# Altium schematic sheet waku-ctl.SchDoc (part 3 of 4)
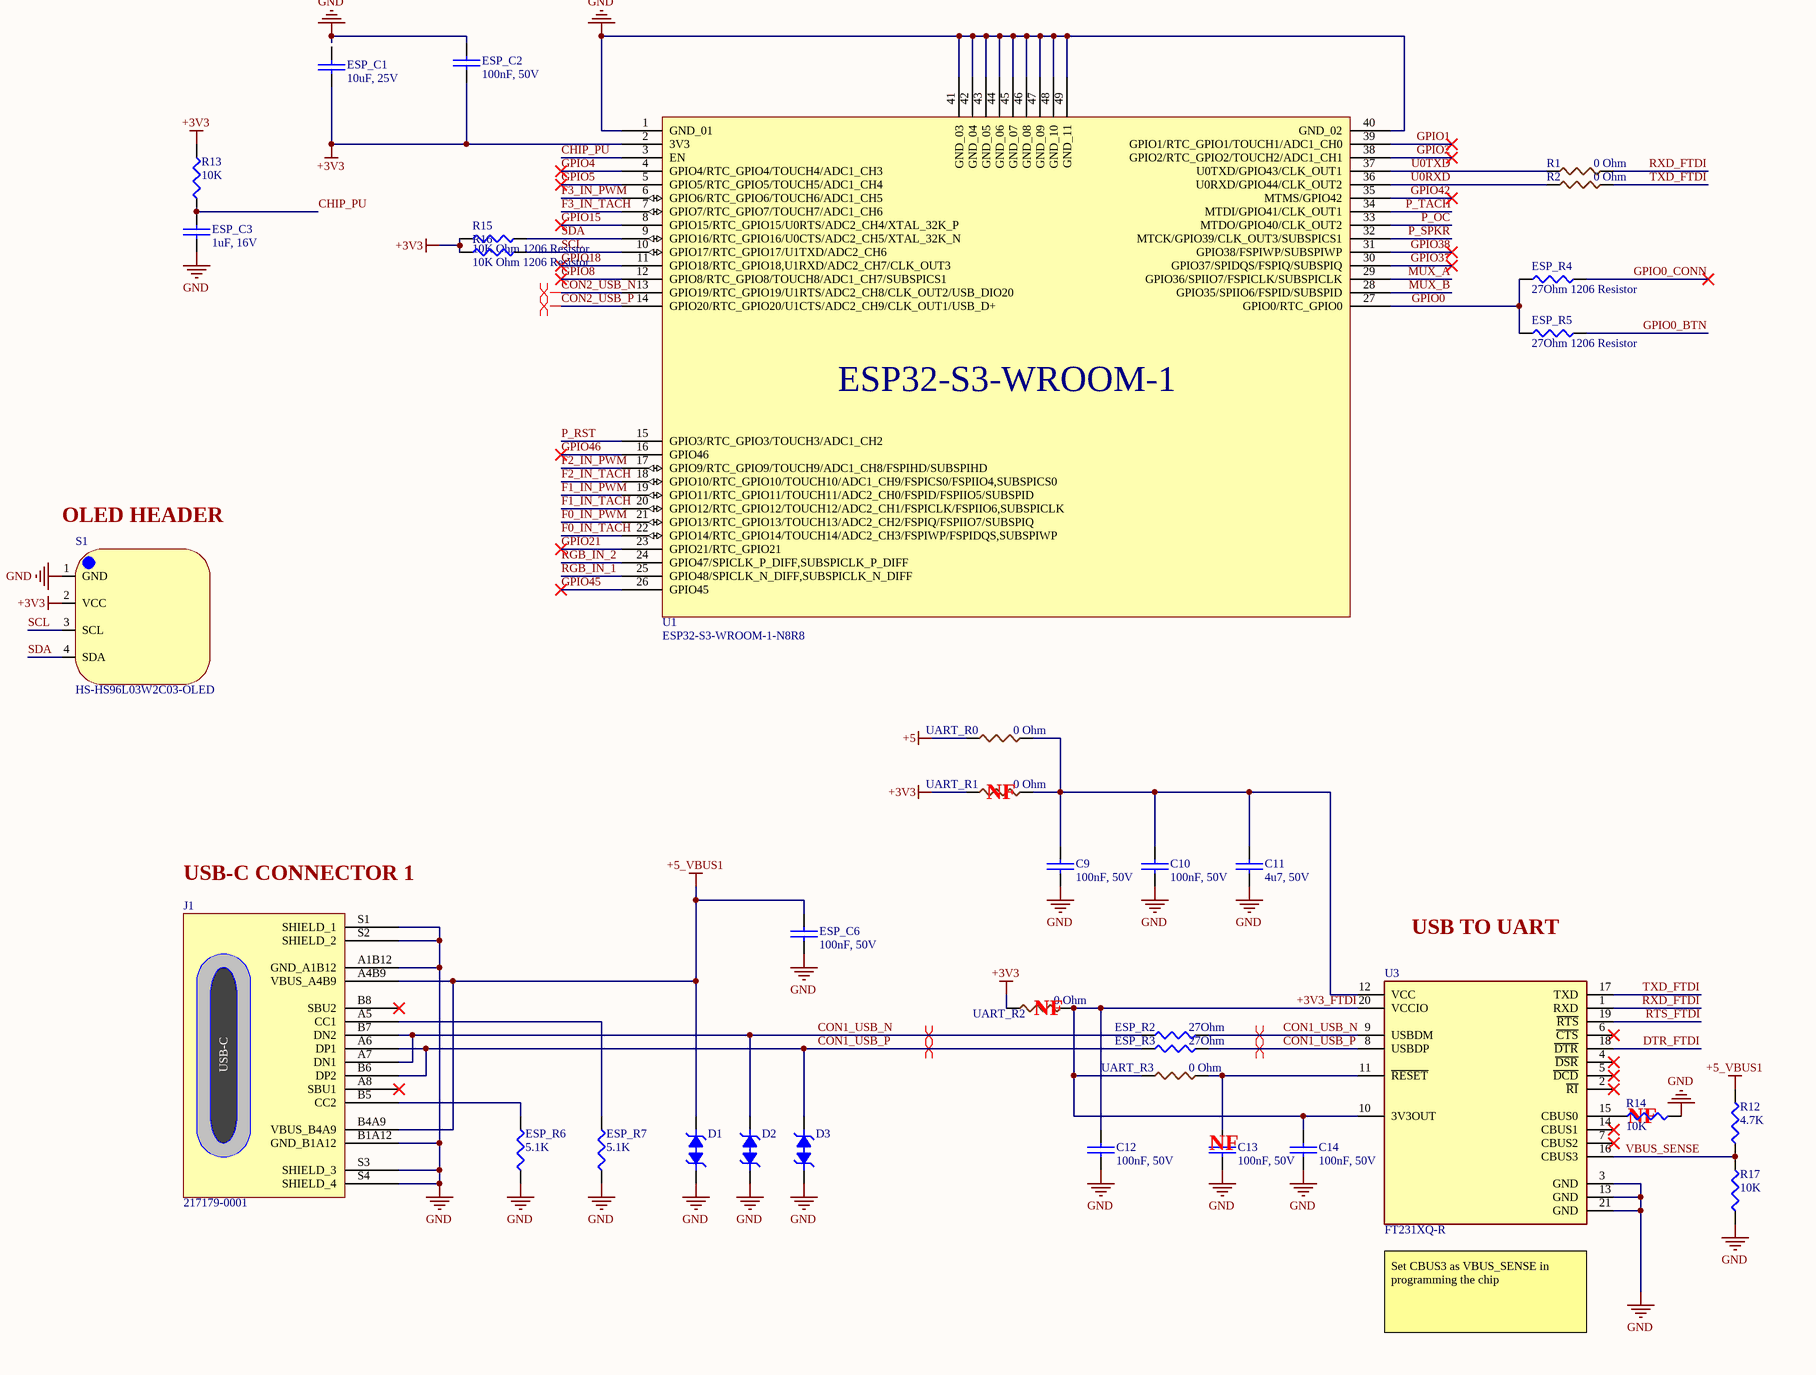
[diagram p5: waku-ctl.SchDoc, bottom right]

## Library data of the parts (continued)
J8-J12 = 47053-1000: CONN HEADER VERT 4POS 2.54MM; Manufacturer: Molex; Manufacturer Lifecycle Status: ACTIVE; Current Rating: 500mA; Dielectric Material: Polyamide; Gender: Male; Glow Wire Compliant: Non-compliant; Number of Circuits: 2; Number of Contacts: 4; Operating Force: 1.946N; Plating: Copper; Plating Thickness: 2.54µm; Voltage Rating: 500V; Voltage Rating (DC): 250V; Supplier: DigiKey; Supplier Part Number: WM4330-ND; Manufacturer Part Number: 47053-1000; RoHS: Compliant; Category: Headers and Wire Housings; Stock: 47133; Pricing: 1=0.42, 10=0.354, 100=0.42, 500=0.26844, 1000=0.25562, 5000=0.22817, 10000=0.21729 (EUR); Ambient Temperature Range High: 105°C; China RoHS: Compliant; Contact Gender: Male; Contact Material: Brass; Contact Plating: Tin; Country of Origin: HK; Depth: 5.84mm; Halogen Free: Low Halogen; Height: 7.7mm; Housing Color: Beige; Housing Material: Nylon; Lead Pitch: 2.54mm; Length: 10.2mm; Lifecycle Status: Production; Max Operating Temperature: 75°C; Min Operating Temperature: -40°C; Mounting Technology: Through Hole; Pins: 4; Number of Positions: 4; Number of Rows: 1; Orientation: Vertical; Packaging: Bulk; Pitch: 2.54mm; Radiation Hardening: No; REACH SVHC: Yes; Schedule B: 8536694040, 8536694040|8536694040|8536694040|8536694040|8536694040|8536694040|8536694040|8536694040|8536694040|8536694040|8536694040|8536694040|8536694040|8536694040|8536694040|8536694040|8536694040|8536694040|8536694040|8536694040|8536694040|8536694040|8536694040|85; Terminal Pitch: 2.54mm; Termination: Through Hole; ComponentLink1URL: https://datasheet.octopart.com:443/47053-1000-Molex-datasheet-154585791.pdf?src-supplier=Sager+Electronics; ComponentLink1Description: https://datasheet.octopart.com:443/47053-1000-Molex-datasheet-154585791.pdf?src-supplier=Sager+Electronics; ComponentLink2URL: https://datasheet.octopart.com:443/47053-1000-Molex-datasheet-13792061.pdf?src-supplier=Sager+Electronics; ComponentLink2Description: https://datasheet.octopart.com:443/47053-1000-Molex-datasheet-13792061.pdf?src-supplier=Sager+Electronics; ComponentLink3URL: https://datasheet.octopart.com:443/0470531000-Molex-datasheet-157440094.pdf?src-supplier=Sager+Electronics; ComponentLink3Description: https://datasheet.octopart.com:443/0470531000-Molex-datasheet-157440094.pdf?src-supplier=Sager+Electronics; ComponentLink4URL: https://sigma.octopart.com:443/154585790/technical_drawing/Molex-47053-1000.pdf?src-supplier=Upverter; ComponentLink4Description: https://sigma.octopart.com:443/154585790/technical_drawing/Molex-47053-1000.pdf?src-supplier=Upverter; ComponentLink5URL: https://datasheet.octopart.com:443/47053-1000-Molex-datasheet-141422371.pdf?src-supplier=Upverter; ComponentLink5Description: https://datasheet.octopart.com:443/47053-1000-Molex-datasheet-141422371.pdf?src-supplier=Upverter; ComponentLink6URL: https://datasheet.octopart.com:443/47053-1000-Molex-datasheet-154585785.pdf?src-supplier=Upverter; ComponentLink6Description: https://datasheet.octopart.com:443/47053-1000-Molex-datasheet-154585785.pdf?src-supplier=Upverter; ComponentLink7URL: https://datasheet.octopart.com:443/47053-1000-Molex-datasheet-16078519.pdf?src-supplier=TME; ComponentLink7Description: https://datasheet.octopart.com:443/47053-1000-Molex-datasheet-16078519.pdf?src-supplier=TME; ComponentLink8URL: https://datasheet.octopart.com:443/470531000-Molex-datasheet-8344792.pdf?src-supplier=Molex; ComponentLink8Description: https://datasheet.octopart.com:443/470531000-Molex-datasheet-8344792.pdf?src-supplier=Molex; ComponentLink9URL: https://datasheet.octopart.com:443/47053-1000-Molex-datasheet-101583033.pdf?src-supplier=element14+APAC; ComponentLink9Description: https://datasheet.octopart.com:443/47053-1000-Molex-datasheet-101583033.pdf?src-supplier=element14+APAC; ComponentLink10URL: https://datasheet.octopart.com:443/47053-1000-Molex-datasheet-154752195.pdf?src-supplier=Master+Electronics; ComponentLink10Description: https://datasheet.octopart.com:443/47053-1000-Molex-datasheet-154752195.pdf?src-supplier=Master+Electronics; ComponentLink11URL: https://datasheet.octopart.com:443/47053-1000-Molex-datasheet-33003494.pdf?src-supplier=Electro+Sonic; ComponentLink11Description: https://datasheet.octopart.com:443/47053-1000-Molex-datasheet-33003494.pdf?src-supplier=Electro+Sonic; ComponentLink12URL: https://datasheet.octopart.com:443/47053-1000-Molex-datasheet-62104864.pdf?src-supplier=Electro+Sonic; ComponentLink12Description: https://datasheet.octopart.com:443/47053-1000-Molex-datasheet-62104864.pdf?src-supplier=Electro+Sonic; ComponentLink13URL: https://datasheet.octopart.com:443/47053-1000-Molex-datasheet-24932734.pdf?src-supplier=Electro+Sonic; ComponentLink13Description: https://datasheet.octopart.com:443/47053-1000-Molex-datasheet-24932734.pdf?src-supplier=Electro+Sonic; ComponentLink14URL: https://datasheet.octopart.com:443/47053-1000-Molex-datasheet-140185186.pdf?src-supplier=RS+(Formerly+Allied+Electronics); ComponentLink14Description: https://datasheet.octopart.com:443/47053-1000-Molex-datasheet-140185186.pdf?src-supplier=RS+(Formerly+Allied+Electronics); ComponentLink15URL: https://datasheet.octopart.com:443/47053-1000-Molex-datasheet-120151286.pdf?src-supplier=RS+(Formerly+Allied+Electronics); ComponentLink15Description: https://datasheet.octopart.com:443/47053-1000-Molex-datasheet-120151286.pdf?src-supplier=RS+(Formerly+Allied+Electronics); ComponentLink16URL: https://datasheet.octopart.com:443/47053-1000-Molex-datasheet-31972472.pdf?src-supplier=RS+(Formerly+Allied+Electronics); ComponentLink16Description: https://datasheet.octopart.com:443/47053-1000-Molex-datasheet-31972472.pdf?src-supplier=RS+(Formerly+Allied+Electronics); ComponentLink17URL: https://datasheet.octopart.com:443/47053-1000-Molex-datasheet-37247467.pdf?src-supplier=RS+(Formerly+Allied+Electronics); ComponentLink17Description: https://datasheet.octopart.com:443/47053-1000-Molex-datasheet-37247467.pdf?src-supplier=RS+(Formerly+Allied+Electronics); ComponentLink18URL: https://datasheet.octopart.com:443/470531000-Molex-datasheet-137316104.pdf?src-supplier=Future+Electronics; ComponentLink18Description: https://datasheet.octopart.com:443/470531000-Molex-datasheet-137316104.pdf?src-supplier=Future+Electronics; ComponentLink19URL: https://datasheet.octopart.com:443/47053-1000-Molex-datasheet-42575110.pdf?src-supplier=Farnell; ComponentLink19Description: https://datasheet.octopart.com:443/47053-1000-Molex-datasheet-42575110.pdf?src-supplier=Farnell; ComponentLink20URL: https://datasheet.octopart.com:443/470531000-Molex-datasheet-151821780.pdf?src-supplier=Toby+Electronics; ComponentLink20Description: https://datasheet.octopart.com:443/470531000-Molex-datasheet-151821780.pdf?src-supplier=Toby+Electronics; ComponentLink21URL: http://sigma.octopart.com:80/16397823/rohs_statement/Molex-47053-1000.pdf?src-supplier=Compliance+Statements; ComponentLink21Description: http://sigma.octopart.com:80/16397823/rohs_statement/Molex-47053-1000.pdf?src-supplier=Compliance+Statements; ComponentLink22URL: http://sigma.octopart.com:80/conflict_mineral_statement/Molex-company-72.pdf?src-supplier=Compliance+Statements; ComponentLink22Description: http://sigma.octopart.com:80/conflict_mineral_statement/Molex-company-72.pdf?src-supplier=Compliance+Statements; ComponentLink23URL: http://sigma.octopart.com:80/rohs_statement/Molex-company-73.pdf?src-supplier=Compliance+Statements; ComponentLink23Description: http://sigma.octopart.com:80/rohs_statement/Molex-company-73.pdf?src-supplier=Compliance+Statements; ComponentLink24URL: http://sigma.octopart.com:80/reach_statement/Molex-company-74.pdf?src-supplier=Compliance+Statements; ComponentLink24Description: http://sigma.octopart.com:80/reach_statement/Molex-company-74.pdf?src-supplier=Compliance+Statements
J13 = SSQ-102-02-T-S-RA: CONN RCPT 2POS 0.1 TIN PCB R/A; Manufacturer: Samtec; Manufacturer Lifecycle Status: PRODUCTION; Connector Type: Receptacle, Socket; Contact Resistance: 10mΩ; Current Rating: 6.3A; Max Current Rating: 7.6A; Max Voltage Rating (AC): 550V; Number of Contacts: 2; Voltage Rating: 655V; Voltage Rating (AC): 465V; Supplier: DigiKey; Supplier Part Number: SAM1195-02-ND; Manufacturer Part Number: SSQ-102-02-T-S-RA; RoHS: Compliant; Category: Headers and Wire Housings; Stock: 1713; Pricing: 1=0.46, 10=0.39, 100=0.46, 500=0.29552, 1000=0.28141, 5000=0.25688 (EUR); Color: Black; Contact Material: Nickel, Tin; Contact Plating: Tin; Depth: 10.03mm; Height: 2.54mm; Housing Color: Black; Lead Free: Lead Free; Lead Length: 2.54mm; Length: 5.59mm; Lifecycle Status: Production; Max Operating Temperature: 105°C; Min Operating Temperature: -55°C; Mounting Technology: Through Hole; Number of Positions: 2; Number of Rows: 1; Orientation: Right Angle; Packaging: Bulk; Pitch: 2.54mm; Radiation Hardening: No; Termination: Solder; Voltage Rating (DC): 655V; Width: 8.51mm; ComponentLink1URL: https://datasheet.octopart.com:443/SSQ-102-02-T-S-RA-Samtec-datasheet-150873487.pdf?src-supplier=Upverter; ComponentLink1Description: https://datasheet.octopart.com:443/SSQ-102-02-T-S-RA-Samtec-datasheet-150873487.pdf?src-supplier=Upverter; ComponentLink2URL: https://sigma.octopart.com:443/17020302/technical_drawing/Samtec-SSQ-102-02-T-S-RA.pdf?src-supplier=Upverter; ComponentLink2Description: https://sigma.octopart.com:443/17020302/technical_drawing/Samtec-SSQ-102-02-T-S-RA.pdf?src-supplier=Upverter; ComponentLink3URL: https://datasheet.octopart.com:443/SSQ-102-02-T-S-RA-Samtec-datasheet-97291133.pdf?src-supplier=element14+APAC; ComponentLink3Description: https://datasheet.octopart.com:443/SSQ-102-02-T-S-RA-Samtec-datasheet-97291133.pdf?src-supplier=element14+APAC; ComponentLink4URL: https://sigma.octopart.com:443/97291134/technical_drawing/Samtec-SSQ-102-02-T-S-RA.pdf?src-supplier=Samtec; ComponentLink4Description: https://sigma.octopart.com:443/97291134/technical_drawing/Samtec-SSQ-102-02-T-S-RA.pdf?src-supplier=Samtec; ComponentLink5URL: https://datasheet.octopart.com:443/SSQ-102-02-T-S-RA-Samtec-datasheet-118235309.pdf?src-supplier=Electro+Sonic; ComponentLink5Description: https://datasheet.octopart.com:443/SSQ-102-02-T-S-RA-Samtec-datasheet-118235309.pdf?src-supplier=Electro+Sonic; ComponentLink6URL: https://datasheet.octopart.com:443/SSQ-102-02-T-S-RA-Samtec-datasheet-86818373.pdf?src-supplier=Sager+Electronics; ComponentLink6Description: https://datasheet.octopart.com:443/SSQ-102-02-T-S-RA-Samtec-datasheet-86818373.pdf?src-supplier=Sager+Electronics; ComponentLink7URL: https://datasheet.octopart.com:443/SSQ-102-02-T-S-RA-Samtec-datasheet-133811811.pdf?src-supplier=JRH+Electronics; ComponentLink7Description: https://datasheet.octopart.com:443/SSQ-102-02-T-S-RA-Samtec-datasheet-133811811.pdf?src-supplier=JRH+Electronics; LCSC Part Number: C6824759
J15-J17 = TS-104-T-AA: NEEDLE CONN HEADER VERT 4POS 2.54MM; Manufacturer: Samtec; Manufacturer Lifecycle Status: PRODUCTION; Gender: Male; Max Current Rating: 1A; Number of Contacts: 4; Supplier: DigiKey; Supplier Part Number: SAM16040-ND; Manufacturer Part Number: TS-104-T-AA; RoHS: Compliant; Category: Headers and Wire Housings; Stock: 919; Pricing: 1=0.62, 50=0.4858, 100=0.62, 500=0.3324, 1000=0.31706 (EUR); Contact Material: Brass; Contact Plating: Tin; Lifecycle Status: Production; Max Operating Temperature: 105°C; Min Operating Temperature: -55°C; Mounting Technology: Through Hole; Number of Rows: 1; Orientation: Straight; Pitch: 2.54mm; Radiation Hardening: No; REACH SVHC: No; Termination: Solder; ComponentLink1URL: https://datasheet.octopart.com:443/TS-104-T-AA-Samtec-datasheet-97318998.pdf?src-supplier=Master+Electronics; ComponentLink1Description: https://datasheet.octopart.com:443/TS-104-T-AA-Samtec-datasheet-97318998.pdf?src-supplier=Master+Electronics; ComponentLink2URL: https://datasheet.octopart.com:443/TS-104-T-AA-Samtec-datasheet-150856305.pdf?src-supplier=Electro+Sonic; ComponentLink2Description: https://datasheet.octopart.com:443/TS-104-T-AA-Samtec-datasheet-150856305.pdf?src-supplier=Electro+Sonic; ComponentLink3URL: https://datasheet.octopart.com:443/TS-104-T-AA-Samtec-datasheet-13698575.pdf?src-supplier=Electro+Sonic; ComponentLink3Description: https://datasheet.octopart.com:443/TS-104-T-AA-Samtec-datasheet-13698575.pdf?src-supplier=Electro+Sonic; ComponentLink4URL: https://datasheet.octopart.com:443/TS-104-T-AA-Samtec-datasheet-37173861.pdf?src-supplier=Electro+Sonic; ComponentLink4Description: https://datasheet.octopart.com:443/TS-104-T-AA-Samtec-datasheet-37173861.pdf?src-supplier=Electro+Sonic; ComponentLink5URL: https://datasheet.octopart.com:443/TS-104-T-AA-Samtec-datasheet-41643166.pdf?src-supplier=Farnell; ComponentLink5Description: https://datasheet.octopart.com:443/TS-104-T-AA-Samtec-datasheet-41643166.pdf?src-supplier=Farnell; ComponentLink6URL: https://datasheet.octopart.com:443/TS-104-T-AA-Samtec-datasheet-28904454.pdf?src-supplier=Farnell; ComponentLink6Description: https://datasheet.octopart.com:443/TS-104-T-AA-Samtec-datasheet-28904454.pdf?src-supplier=Farnell; ComponentLink7URL: https://datasheet.octopart.com:443/TS-104-T-AA-Samtec-datasheet-8451641.pdf?src-supplier=Farnell; ComponentLink7Description: https://datasheet.octopart.com:443/TS-104-T-AA-Samtec-datasheet-8451641.pdf?src-supplier=Farnell; ComponentLink8URL: https://datasheet.octopart.com:443/TS-104-T-AA-Samtec-datasheet-179090728.pdf?src-supplier=Sager+Electronics; ComponentLink8Description: https://datasheet.octopart.com:443/TS-104-T-AA-Samtec-datasheet-179090728.pdf?src-supplier=Sager+Electronics; ComponentLink9URL: https://datasheet.octopart.com:443/TS-104-T-AA-Samtec-datasheet-118235246.pdf?src-supplier=Sager+Electronics; ComponentLink9Description: https://datasheet.octopart.com:443/TS-104-T-AA-Samtec-datasheet-118235246.pdf?src-supplier=Sager+Electronics; ComponentLink10URL: https://datasheet.octopart.com:443/TS-104-T-AA-Samtec-datasheet-116533476.pdf?src-supplier=Toby+Electronics; ComponentLink10Description: https://datasheet.octopart.com:443/TS-104-T-AA-Samtec-datasheet-116533476.pdf?src-supplier=Toby+Electronics; ComponentLink11URL: https://datasheet.octopart.com:443/TS-104-T-AA-Samtec-datasheet-116536303.pdf?src-supplier=Toby+Electronics; ComponentLink11Description: https://datasheet.octopart.com:443/TS-104-T-AA-Samtec-datasheet-116536303.pdf?src-supplier=Toby+Electronics
JMP1 JMP2 = M50-1920005: CONN SHUNT 1.27MM; Manufacturer: Harwin; Contact Resistance: 20mΩ; Current Rating: 1A; Insulation Resistance: 1GΩ; Number of Positions: 2; Voltage Rating: 500V; Supplier: DigiKey; Supplier Part Number: 952-1727-ND; Manufacturer Part Number: M50-1920005; RoHS: Compliant; Category: Headers and Wire Housings; Stock: 2688; Pricing: 1=0.33, 10=0.284, 25=0.2664, 50=0.2536, 100=0.2414, 250=0.22628, 500=0.21546, 1000=0.20516, 3000=0.18984 (USD); Color: Red; Contact Gender: Female; Contact Plating: Gold; Flammability Rating: UL94 V-0; Height: 2.9972mm; Housing Material: Nylon; Lifecycle Status: Production; Max Operating Temperature: 105°C; Min Operating Temperature: -40°C; Pins: 2; Pitch: 1.27mm; REACH SVHC: Yes; ComponentLink1URL: https://datasheet.octopart.com:443/M50-1920005-Harwin-datasheet-179992058.pdf?src-supplier=IHS; ComponentLink1Description: https://datasheet.octopart.com:443/M50-1920005-Harwin-datasheet-179992058.pdf?src-supplier=IHS; ComponentLink2URL: https://datasheet.octopart.com:443/M50-1920005-Harwin-datasheet-27707384.pdf?src-supplier=Newark; ComponentLink2Description: https://datasheet.octopart.com:443/M50-1920005-Harwin-datasheet-27707384.pdf?src-supplier=Newark; ComponentLink3URL: https://datasheet.octopart.com:443/M50-1920005-Harwin-datasheet-10841850.pdf?src-supplier=element14+APAC; ComponentLink3Description: https://datasheet.octopart.com:443/M50-1920005-Harwin-datasheet-10841850.pdf?src-supplier=element14+APAC; LCSC Part Number: C2758458
OP1 = PS2701A-1-F3-A: OPTOISO 3.75KV 1CH TRANS 4-SOP; Manufacturer: Renesas; Manufacturer Lifecycle Status: ACTIVE; Collector Emitter Breakdown Voltage: 70V; Collector Emitter Saturation Voltage: 300mV; Current Transfer Ratio: 50%; Dark Current: 100nA; Fall Time: 7µs; Forward Current: 50mA; Forward Voltage: 1.4V; Input Current: 5mA; Max Collector Current: 30mA; Max Power Dissipation: 230mW; Number of Channels: 1; Output Voltage: 40V; RAM Size: 16kB; Reverse Breakdown Voltage: 6V; Rise Time: 5µs; Supplier: DigiKey; Supplier Part Number: 559-1154-1-ND; Manufacturer Part Number: PS2701A-1-F3-A; RoHS: Compliant; Category: Optocouplers; Stock: 13270; Pricing: 1=0.84, 10=0.591, 100=0.84, 500=0.36802, 1000=0.34545 (EUR); Case/Package: SOP; China RoHS: Compliant; Collector Emitter Voltage (VCEO): 70V; Contact Plating: Tin Bismuth; Export Control Classification Number (ECCN) Code: EAR99; Part Family: PS2701A-1; Height: 2.3mm; Harmonized Tariff Schedule (HTS) Code: 8541.49.8000; Isolation Voltage: 3.75kV; Lead Free: Lead Free; Lifecycle Status: Production; Max Input Current: 30mA; Max Operating Temperature: 100°C; Max Output Voltage: 70V; Min Operating Temperature: -55°C; MSL: 1; Mounting Technology: Surface Mount; Number of Circuits: 1; Number of Elements: 1; Pins: 4; Power Dissipation: 230mW; Radiation Hardening: No; REACH SVHC: Yes; Reverse Voltage: 6V; ComponentLink1URL: https://datasheet.octopart.com:443/PS2701A-1-F3-A-Renesas-datasheet-157819089.pdf?src-supplier=Newark; ComponentLink1Description: https://datasheet.octopart.com:443/PS2701A-1-F3-A-Renesas-datasheet-157819089.pdf?src-supplier=Newark; ComponentLink2URL: https://datasheet.octopart.com:443/PS2701A-1-F3-A-Renesas-datasheet-179182223.pdf?src-supplier=Integrated+Device+Technology; ComponentLink2Description: https://datasheet.octopart.com:443/PS2701A-1-F3-A-Renesas-datasheet-179182223.pdf?src-supplier=Integrated+Device+Technology; ComponentLink3URL: https://datasheet.octopart.com:443/PS2701A-1-F3-A-Renesas-datasheet-149188193.pdf?src-supplier=Integrated+Device+Technology; ComponentLink3Description: https://datasheet.octopart.com:443/PS2701A-1-F3-A-Renesas-datasheet-149188193.pdf?src-supplier=Integrated+Device+Technology; ComponentLink4URL: https://datasheet.octopart.com:443/PS2701A-1-F3-A-NEC-datasheet-180895236.pdf?src-supplier=IHS; ComponentLink4Description: https://datasheet.octopart.com:443/PS2701A-1-F3-A-NEC-datasheet-180895236.pdf?src-supplier=IHS; ComponentLink5URL: https://datasheet.octopart.com:443/PS2701A-1-F3-A-Renesas-datasheet-141895261.pdf?src-supplier=Renesas; ComponentLink5Description: https://datasheet.octopart.com:443/PS2701A-1-F3-A-Renesas-datasheet-141895261.pdf?src-supplier=Renesas; ComponentLink6URL: https://datasheet.octopart.com:443/PS2701A-1-F3-A-Renesas-datasheet-138175344.pdf?src-supplier=Renesas; ComponentLink6Description: https://datasheet.octopart.com:443/PS2701A-1-F3-A-Renesas-datasheet-138175344.pdf?src-supplier=Renesas; ComponentLink7URL: https://datasheet.octopart.com:443/PS2701A-1-F3-A-Renesas-datasheet-5436770.pdf?src-supplier=element14+APAC; ComponentLink7Description: https://datasheet.octopart.com:443/PS2701A-1-F3-A-Renesas-datasheet-5436770.pdf?src-supplier=element14+APAC; ComponentLink8URL: https://datasheet.octopart.com:443/PS2701A-1-F3-A-Renesas-datasheet-164380605.pdf?src-supplier=SOS+electronic; ComponentLink8Description: https://datasheet.octopart.com:443/PS2701A-1-F3-A-Renesas-datasheet-164380605.pdf?src-supplier=SOS+electronic; ComponentLink9URL: https://datasheet.octopart.com:443/PS2701A-1-F3-A-Renesas-datasheet-134697512.pdf?src-supplier=TME; ComponentLink9Description: https://datasheet.octopart.com:443/PS2701A-1-F3-A-Renesas-datasheet-134697512.pdf?src-supplier=TME; ComponentLink10URL: https://datasheet.octopart.com:443/PS2701A-1-F3-A-Renesas-datasheet-136482170.pdf?src-supplier=Future+Electronics; ComponentLink10Description: https://datasheet.octopart.com:443/PS2701A-1-F3-A-Renesas-datasheet-136482170.pdf?src-supplier=Future+Electronics; ComponentLink11URL: http://sigma.octopart.com:80/conflict_mineral_statement/Renesas-company-44.pdf?src-supplier=Compliance+Statements; ComponentLink11Description: http://sigma.octopart.com:80/conflict_mineral_statement/Renesas-company-44.pdf?src-supplier=Compliance+Statements; ComponentLink12URL: http://sigma.octopart.com:80/reach_statement/Renesas-company-45.pdf?src-supplier=Compliance+Statements; ComponentLink12Description: http://sigma.octopart.com:80/reach_statement/Renesas-company-45.pdf?src-supplier=Compliance+Statements
Q2 Q3 = SS8050-G: TRANS NPN 25V 1.5A SOT-23-3; Manufacturer: Comchip; Collector Base Voltage (VCBO): 40V; Collector Emitter Saturation Voltage: 500mV; Emitter Base Voltage (VEBO): 5V; hFE Min: 40; Max Junction Temperature (Tj): 150°C; Max Power Dissipation: 300mW; Number of Elements: 1; Transition Frequency: 100MHz; Supplier: DigiKey; Supplier Part Number: 641-1790-1-ND; Manufacturer Part Number: SS8050-G; RoHS: Compliant; Category: BJTs; Stock: 59487; Pricing: 1=0.2, 10=0.126, 100=0.2, 500=0.05756, 1000=0.05078 (EUR); Case/Package: TO-236-3; Collector Emitter Breakdown Voltage: 25V; Collector Emitter Voltage (VCEO): 25V; Height: 1.15mm; Lifecycle Status: Production; Max Breakdown Voltage: 25V; Max Collector Current: 1.5A; Max Operating Temperature: 150°C; Mounting Technology: Surface Mount; Number of Terminals: 3; Power Dissipation: 300mW; REACH SVHC: Yes; Schedule B: 8541100070|8541100070|8541100070|8541100070|8541100070; ComponentLink1URL: https://datasheet.octopart.com:443/SS8050-G-Comchip-datasheet-180131983.pdf?src-supplier=IHS; ComponentLink1Description: https://datasheet.octopart.com:443/SS8050-G-Comchip-datasheet-180131983.pdf?src-supplier=IHS; ComponentLink2URL: https://datasheet.octopart.com:443/SS8050-G-Comchip-datasheet-155422643.pdf?src-supplier=Upverter; ComponentLink2Description: https://datasheet.octopart.com:443/SS8050-G-Comchip-datasheet-155422643.pdf?src-supplier=Upverter; ComponentLink3URL: https://datasheet.octopart.com:443/SS8050-G-Comchip-datasheet-189767092.pdf?src-supplier=ODG+(Origin+Data+Global); ComponentLink3Description: https://datasheet.octopart.com:443/SS8050-G-Comchip-datasheet-189767092.pdf?src-supplier=ODG+(Origin+Data+Global); LCSC Part Number: C164886
R1 R2 UART_R0-UART_R3 = RC1206FR-070RL: RES 0 OHM JUMPER 1/4W 1206; Manufacturer: Yageo Group; Max Power Dissipation: 250mW; Value: 0Ω; Tolerance: 1%; Voltage Rating: 200V; Supplier: DigiKey; Supplier Part Number: YAG3367CT-ND; Manufacturer Part Number: RC1206FR-070RL; RoHS: Compliant; Category: Chip SMD Resistors; Pricing: 1=0.1, 10=0.027, 25=0.0228, 50=0.02, 100=0.0175, 250=0.0148, 500=0.0131, 1000=0.01164, 5000=0.00905, 10000=0.00821, 15000=0.00777, 25000=0.00728, 35000=0.00698, 50000=0.0067, 60000=0.00656, 120000=0.00608, 125000=0.00606 (USD); Case/Package: 1206; Case Code (Imperial): 1206; Case Code (Metric): 3216; China RoHS: Non-Compliant; Composition: Thick Film; Contact Plating: Tin; Features: Moisture Resistant; Height: 550µm; Lead Free: Lead Free; Length: 3.0988mm; Lifecycle Status: Production; Max Operating Temperature: 155°C; Min Operating Temperature: -55°C; Mounting Technology: Surface Mount; Number of Terminals: 2; Number of Terminations: 2; Packaging: Tape & Reel; Power Dissipation: 250mW; Power Rating: 250mW; Radiation Hardening: No; REACH SVHC: Yes; Width: 1.6mm; ComponentLink1URL: https://datasheet.octopart.com:443/RC1206FR-070RL-Yageo-datasheet-141265859.pdf?src-supplier=Upverter; ComponentLink1Description: https://datasheet.octopart.com:443/RC1206FR-070RL-Yageo-datasheet-141265859.pdf?src-supplier=Upverter; ComponentLink2URL: https://datasheet.octopart.com:443/RC1206FR-070RL-Yageo-datasheet-8359522.pdf?src-supplier=IHS; ComponentLink2Description: https://datasheet.octopart.com:443/RC1206FR-070RL-Yageo-datasheet-8359522.pdf?src-supplier=IHS; ComponentLink3URL: https://datasheet.octopart.com:443/RC1206FR-070RL-Yageo-datasheet-164759695.pdf?src-supplier=Future+Electronics; ComponentLink3Description: https://datasheet.octopart.com:443/RC1206FR-070RL-Yageo-datasheet-164759695.pdf?src-supplier=Future+Electronics; ComponentLink4URL: https://datasheet.octopart.com:443/RC1206FR-070RL-Yageo-datasheet-137700087.pdf?src-supplier=Future+Electronics; ComponentLink4Description: https://datasheet.octopart.com:443/RC1206FR-070RL-Yageo-datasheet-137700087.pdf?src-supplier=Future+Electronics; ComponentLink5URL: https://datasheet.octopart.com:443/RC1206FR-070RL-Yageo-datasheet-27233761.pdf?src-supplier=Future+Electronics; ComponentLink5Description: https://datasheet.octopart.com:443/RC1206FR-070RL-Yageo-datasheet-27233761.pdf?src-supplier=Future+Electronics; ComponentLink6URL: https://datasheet.octopart.com:443/RC1206FR-070RL-Yageo-datasheet-13032847.pdf?src-supplier=Future+Electronics; ComponentLink6Description: https://datasheet.octopart.com:443/RC1206FR-070RL-Yageo-datasheet-13032847.pdf?src-supplier=Future+Electronics; ComponentLink7URL: https://datasheet.octopart.com/RC1206FR-070RL-Yageo-datasheet-73766026.pdf; ComponentLink7Description: https://datasheet.octopart.com/RC1206FR-070RL-Yageo-datasheet-73766026.pdf; ComponentLink8URL: http://sigma.octopart.com:80/rohs_statement/Yageo-company-2.pdf?src-supplier=Compliance+Statements; ComponentLink8Description: http://sigma.octopart.com:80/rohs_statement/Yageo-company-2.pdf?src-supplier=Compliance+Statements; ComponentLink9URL: http://sigma.octopart.com:80/conflict_mineral_statement/Yageo-company-3.pdf?src-supplier=Compliance+Statements; ComponentLink9Description: http://sigma.octopart.com:80/conflict_mineral_statement/Yageo-company-3.pdf?src-supplier=Compliance+Statements; LCSC Part Number: C137394
R3-R6 R8-R11 R13-R20 = RC1206FR-0710KL: RES 10K OHM 1% 1/4W 1206; Manufacturer: Yageo Group; Power Dissipation: 250mW; Value: 10kΩ; Temperature Coefficient: 100ppm/°C; Voltage Rating: 200V; Supplier: DigiKey; Supplier Part Number: 311-10.0KFRCT-ND; Manufacturer Part Number: RC1206FR-0710KL; RoHS: Compliant; Category: Chip SMD Resistors; Stock: 1065455; Pricing: 1=0.09, 10=0.015, 25=0.09, 50=0.0096 (EUR); Case/Package: 1206; Case Code (Imperial): 1206; Case Code (Metric): 3216; China RoHS: Non-Compliant; Composition: Thick Film; Depth: 1.6mm; Height: 550µm; Lead Free: Lead Free; Length: 3.1mm; Lifecycle Status: Production; Max Operating Temperature: 155°C; Military Standard: Not; Min Operating Temperature: -55°C; Mounting Technology: Surface Mount; Pins: 2; Number of Terminals: 2; Packaging: Cut Tape; Power Rating: 250mW; REACH SVHC: Yes; Schedule B: 8533210045, 8533210045|8533210045|8533210045|8533210045|8533210045|8533210045|8533210045|8533210045|8533210045|8533210045|8533210045|8533210045|8533210045|8533210045|8533210045|8533210045|8533210045, 8533210045|8533210045|8533210045|8533210045|8533210045|8533210045|8533210045|8533210045|8533210045|8533210045|8533210045|8533210045|8533210045|8533210045|8533210045|8533210045|8533210045|8533210045, 8533210045|8533210045|8533210045|8533210045|8533210045|8533210045|8533210045|8533210045|8533210045|8533210045|8533210045|8533210045|8533210045|8533210045|8533210045|8533210045|8533210045|8533210045|8533210045; Termination: SMD/SMT; Tolerance: 1%; Voltage Rating (AC): 200V; Voltage Rating (DC): 200V; Width: 1.6mm; Working Voltage: 200V; ComponentLink1URL: https://datasheet.octopart.com:443/RC1206FR-0710KL-Yageo-datasheet-175887523.pdf?src-supplier=IHS; ComponentLink1Description: https://datasheet.octopart.com:443/RC1206FR-0710KL-Yageo-datasheet-175887523.pdf?src-supplier=IHS; ComponentLink2URL: https://datasheet.octopart.com:443/RC1206FR-0710KL-Yageo-datasheet-103092701.pdf?src-supplier=Upverter; ComponentLink2Description: https://datasheet.octopart.com:443/RC1206FR-0710KL-Yageo-datasheet-103092701.pdf?src-supplier=Upverter; ComponentLink3URL: https://datasheet.octopart.com:443/RC1206FR-0710KL-Yageo-datasheet-98239111.pdf?src-supplier=Upverter; ComponentLink3Description: https://datasheet.octopart.com:443/RC1206FR-0710KL-Yageo-datasheet-98239111.pdf?src-supplier=Upverter; ComponentLink4URL: https://datasheet.octopart.com:443/RC1206FR-0710KL-Yageo-datasheet-8359522.pdf?src-supplier=TME; ComponentLink4Description: https://datasheet.octopart.com:443/RC1206FR-0710KL-Yageo-datasheet-8359522.pdf?src-supplier=TME; ComponentLink5URL: https://datasheet.octopart.com:443/RC1206FR-0710KL-Yageo-datasheet-13032847.pdf?src-supplier=Farnell; ComponentLink5Description: https://datasheet.octopart.com:443/RC1206FR-0710KL-Yageo-datasheet-13032847.pdf?src-supplier=Farnell; ComponentLink6URL: https://datasheet.octopart.com:443/RC1206FR-0710KL-Yageo-datasheet-62067350.pdf?src-supplier=Farnell; ComponentLink6Description: https://datasheet.octopart.com:443/RC1206FR-0710KL-Yageo-datasheet-62067350.pdf?src-supplier=Farnell; ComponentLink7URL: https://datasheet.octopart.com:443/RC1206FR-0710KL-Yageo-datasheet-176638170.pdf?src-supplier=JRH+Electronics; ComponentLink7Description: https://datasheet.octopart.com:443/RC1206FR-0710KL-Yageo-datasheet-176638170.pdf?src-supplier=JRH+Electronics; ComponentLink8URL: https://datasheet.octopart.com:443/RC1206FR-0710KL-Yageo-datasheet-164759695.pdf?src-supplier=Future+Electronics; ComponentLink8Description: https://datasheet.octopart.com:443/RC1206FR-0710KL-Yageo-datasheet-164759695.pdf?src-supplier=Future+Electronics; ComponentLink9URL: https://datasheet.octopart.com:443/RC1206FR-0710KL-Yageo-datasheet-137700087.pdf?src-supplier=Future+Electronics; ComponentLink9Description: https://datasheet.octopart.com:443/RC1206FR-0710KL-Yageo-datasheet-137700087.pdf?src-supplier=Future+Electronics; ComponentLink10URL: https://datasheet.octopart.com:443/RC1206FR-0710KL-Yageo-datasheet-27233761.pdf?src-supplier=Future+Electronics; ComponentLink10Description: https://datasheet.octopart.com:443/RC1206FR-0710KL-Yageo-datasheet-27233761.pdf?src-supplier=Future+Electronics; ComponentLink11URL: https://datasheet.octopart.com:443/RC1206FR-0710KL-Yageo-datasheet-8324387.pdf?src-supplier=Future+Electronics; ComponentLink11Description: https://datasheet.octopart.com:443/RC1206FR-0710KL-Yageo-datasheet-8324387.pdf?src-supplier=Future+Electronics; ComponentLink12URL: https://datasheet.octopart.com:443/RC1206FR-0710KL-Yageo-datasheet-79472498.pdf?src-supplier=Megastar; ComponentLink12Description: https://datasheet.octopart.com:443/RC1206FR-0710KL-Yageo-datasheet-79472498.pdf?src-supplier=Megastar; ComponentLink13URL: https://datasheet.octopart.com/RC1206FR-0710KL-Yageo-datasheet-73766026.pdf; ComponentLink13Description: https://datasheet.octopart.com/RC1206FR-0710KL-Yageo-datasheet-73766026.pdf; ComponentLink14URL: https://datasheet.octopart.com:443/RC1206FR-0710KL-Yageo-datasheet-118639.pdf?src-supplier=DigiKey; ComponentLink14Description: https://datasheet.octopart.com:443/RC1206FR-0710KL-Yageo-datasheet-118639.pdf?src-supplier=DigiKey; ComponentLink15URL: https://datasheet.octopart.com:443/RC1206FR-0710KL-Yageo-datasheet-499455.pdf?src-supplier=element14; ComponentLink15Description: https://datasheet.octopart.com:443/RC1206FR-0710KL-Yageo-datasheet-499455.pdf?src-supplier=element14; ComponentLink16URL: https://datasheet.octopart.com:443/RC1206FR-0710KL-Yageo-datasheet-6387275.pdf?src-supplier=element14; ComponentLink16Description: https://datasheet.octopart.com:443/RC1206FR-0710KL-Yageo-datasheet-6387275.pdf?src-supplier=element14; ComponentLink17URL: http://sigma.octopart.com:80/rohs_statement/Yageo-company-2.pdf?src-supplier=Compliance+Statements; ComponentLink17Description: http://sigma.octopart.com:80/rohs_statement/Yageo-company-2.pdf?src-supplier=Compliance+Statements; ComponentLink18URL: http://sigma.octopart.com:80/conflict_mineral_statement/Yageo-company-3.pdf?src-supplier=Compliance+Statements; ComponentLink18Description: http://sigma.octopart.com:80/conflict_mineral_statement/Yageo-company-3.pdf?src-supplier=Compliance+Statements; LCSC Part Number: C132649
R7 = RC1206FR-071KL: RES 1K OHM 1% 1/4W 1206; Manufacturer: Yageo Group; Power Dissipation: 250mW; Value: 1kΩ; Temperature Coefficient: 100ppm/°C; Voltage Rating: 200V; Supplier: DigiKey; Supplier Part Number: 311-1.00KFRCT-ND; Manufacturer Part Number: RC1206FR-071KL; RoHS: Compliant; Category: Chip SMD Resistors; Pricing: 1=0.09, 10=0.035, 25=0.09, 50=0.0218, 100=0.0181, 250=0.01444, 500=0.01234, 1000=0.01069 (EUR); Case/Package: 1206; Case Code (Imperial): 1206; Case Code (Metric): 3216; China RoHS: Non-Compliant; Composition: Thick Film; Depth: 1.6mm; Height: 550µm; Lead Free: Lead Free; Length: 3.2mm; Lifecycle Status: Production; Max Operating Temperature: 155°C; Military Standard: Not; Min Operating Temperature: -55°C; Mounting Technology: Surface Mount; Pins: 2; Number of Terminals: 2; Packaging: Tape & Reel; Power Rating: 250mW; REACH SVHC: Yes; Schedule B: 8533210045, 8533210045|8533210045, 8533210045|8533210045|8533210045, 8533210045|8533210045|8533210045|8533210045; Termination: SMD/SMT; Tolerance: 1%; Voltage Rating (AC): 200V; Voltage Rating (DC): 200V; Width: 1.6mm; Working Voltage: 200V; ComponentLink1URL: https://datasheet.octopart.com:443/RC1206FR-071KL-Yageo-datasheet-175887523.pdf?src-supplier=Newark; ComponentLink1Description: https://datasheet.octopart.com:443/RC1206FR-071KL-Yageo-datasheet-175887523.pdf?src-supplier=Newark; ComponentLink2URL: https://datasheet.octopart.com:443/RC1206FR-071KL-Yageo-datasheet-103092701.pdf?src-supplier=Upverter; ComponentLink2Description: https://datasheet.octopart.com:443/RC1206FR-071KL-Yageo-datasheet-103092701.pdf?src-supplier=Upverter; ComponentLink3URL: https://datasheet.octopart.com:443/RC1206FR-071KL-Yageo-datasheet-98239111.pdf?src-supplier=Upverter; ComponentLink3Description: https://datasheet.octopart.com:443/RC1206FR-071KL-Yageo-datasheet-98239111.pdf?src-supplier=Upverter; ComponentLink4URL: https://datasheet.octopart.com:443/RC1206FR-071KL-Yageo-datasheet-8359522.pdf?src-supplier=element14+APAC; ComponentLink4Description: https://datasheet.octopart.com:443/RC1206FR-071KL-Yageo-datasheet-8359522.pdf?src-supplier=element14+APAC; ComponentLink5URL: https://datasheet.octopart.com:443/RC1206FR-071KL-Yageo-datasheet-13032847.pdf?src-supplier=element14+APAC; ComponentLink5Description: https://datasheet.octopart.com:443/RC1206FR-071KL-Yageo-datasheet-13032847.pdf?src-supplier=element14+APAC; ComponentLink6URL: https://datasheet.octopart.com:443/RC1206FR-071KL-Yageo-datasheet-62067350.pdf?src-supplier=Farnell; ComponentLink6Description: https://datasheet.octopart.com:443/RC1206FR-071KL-Yageo-datasheet-62067350.pdf?src-supplier=Farnell; ComponentLink7URL: https://datasheet.octopart.com:443/RC1206FR-071KL-Yageo-datasheet-164759695.pdf?src-supplier=Future+Electronics; ComponentLink7Description: https://datasheet.octopart.com:443/RC1206FR-071KL-Yageo-datasheet-164759695.pdf?src-supplier=Future+Electronics; ComponentLink8URL: https://datasheet.octopart.com:443/RC1206FR-071KL-Yageo-datasheet-137700087.pdf?src-supplier=Future+Electronics; ComponentLink8Description: https://datasheet.octopart.com:443/RC1206FR-071KL-Yageo-datasheet-137700087.pdf?src-supplier=Future+Electronics; ComponentLink9URL: https://datasheet.octopart.com:443/RC1206FR-071KL-Yageo-datasheet-27233761.pdf?src-supplier=Future+Electronics; ComponentLink9Description: https://datasheet.octopart.com:443/RC1206FR-071KL-Yageo-datasheet-27233761.pdf?src-supplier=Future+Electronics; ComponentLink10URL: https://datasheet.octopart.com:443/RC1206FR-071KL-Yageo-datasheet-8324387.pdf?src-supplier=Future+Electronics; ComponentLink10Description: https://datasheet.octopart.com:443/RC1206FR-071KL-Yageo-datasheet-8324387.pdf?src-supplier=Future+Electronics; ComponentLink11URL: https://datasheet.octopart.com:443/RC1206FR-071KL-Yageo-datasheet-79472498.pdf?src-supplier=Megastar; ComponentLink11Description: https://datasheet.octopart.com:443/RC1206FR-071KL-Yageo-datasheet-79472498.pdf?src-supplier=Megastar; ComponentLink12URL: https://datasheet.octopart.com/RC1206FR-071KL-Yageo-datasheet-73766026.pdf; ComponentLink12Description: https://datasheet.octopart.com/RC1206FR-071KL-Yageo-datasheet-73766026.pdf; ComponentLink13URL: https://datasheet.octopart.com:443/RC1206FR-071KL-Yageo-datasheet-118639.pdf?src-supplier=DigiKey; ComponentLink13Description: https://datasheet.octopart.com:443/RC1206FR-071KL-Yageo-datasheet-118639.pdf?src-supplier=DigiKey; ComponentLink14URL: http://sigma.octopart.com:80/rohs_statement/Yageo-company-2.pdf?src-supplier=Compliance+Statements; ComponentLink14Description: http://sigma.octopart.com:80/rohs_statement/Yageo-company-2.pdf?src-supplier=Compliance+Statements; ComponentLink15URL: http://sigma.octopart.com:80/conflict_mineral_statement/Yageo-company-3.pdf?src-supplier=Compliance+Statements; ComponentLink15Description: http://sigma.octopart.com:80/conflict_mineral_statement/Yageo-company-3.pdf?src-supplier=Compliance+Statements; LCSC Part Number: C131398
R12 = RC1206FR-074K7L: RES 4.7K OHM 1% 1/4W 1206; Manufacturer: Yageo Group; Max Power Dissipation: 250mW; Value: 4.7kΩ; Temperature Coefficient: 100ppm/°C; Voltage Rating: 200V; Supplier: DigiKey; Supplier Part Number: 311-4.70KFRCT-ND; Manufacturer Part Number: RC1206FR-074K7L; RoHS: Compliant; Category: Chip SMD Resistors; Stock: 1277228; Pricing: 1=0.1, 10=0.015, 25=0.0136, 50=0.0102 (USD); Case/Package: 1206; Case Code (Imperial): 1206; Case Code (Metric): 3216; China RoHS: Non-Compliant; Composition: Thick Film; Depth: 1.6mm; Features: Moisture Resistant; Height: 550µm; Lead Free: Lead Free; Length: 3.1mm; Lifecycle Status: Production; Max Operating Temperature: 155°C; Military Standard: Not; Min Operating Temperature: -55°C; Mounting Technology: Surface Mount; Pins: 2; Number of Terminals: 2; Number of Terminations: 2; Packaging: Tape & Reel; Power Dissipation: 250mW; Power Rating: 250mW; REACH SVHC: Yes; Schedule B: 8533210045, 8533210045|8533210045|8533210045|8533210045|8533210045|8533210045|8533210045|8533210045|8533210045|8533210045|8533210045|8533210045|8533210045|8533210045|8533210045|8533210045|8533210045|8533210045|8533210045|8533210045|8533210045|8533210045|8533210045|85; Termination: SMD/SMT; Tolerance: 1%; Voltage Rating (AC): 200V; Voltage Rating (DC): 200V; Width: 1.6mm; Working Voltage: 200V; ComponentLink1URL: https://datasheet.octopart.com:443/RC1206FR-074K7L-Yageo-datasheet-175887523.pdf?src-supplier=IHS; ComponentLink1Description: https://datasheet.octopart.com:443/RC1206FR-074K7L-Yageo-datasheet-175887523.pdf?src-supplier=IHS; ComponentLink2URL: https://datasheet.octopart.com:443/RC1206FR-074K7L-Yageo-datasheet-141265859.pdf?src-supplier=Upverter; ComponentLink2Description: https://datasheet.octopart.com:443/RC1206FR-074K7L-Yageo-datasheet-141265859.pdf?src-supplier=Upverter; ComponentLink3URL: https://datasheet.octopart.com:443/RC1206FR-074K7L-Yageo-datasheet-103092701.pdf?src-supplier=Upverter; ComponentLink3Description: https://datasheet.octopart.com:443/RC1206FR-074K7L-Yageo-datasheet-103092701.pdf?src-supplier=Upverter; ComponentLink4URL: https://sigma.octopart.com:443/138820526/technical_drawing/Yageo-RC1206FR-074K7L.pdf?src-supplier=Upverter; ComponentLink4Description: https://sigma.octopart.com:443/138820526/technical_drawing/Yageo-RC1206FR-074K7L.pdf?src-supplier=Upverter; ComponentLink5URL: https://datasheet.octopart.com:443/RC1206FR-074K7L-Yageo-datasheet-8359522.pdf?src-supplier=element14+APAC; ComponentLink5Description: https://datasheet.octopart.com:443/RC1206FR-074K7L-Yageo-datasheet-8359522.pdf?src-supplier=element14+APAC; ComponentLink6URL: https://datasheet.octopart.com:443/RC1206FR-074K7L-Yageo-datasheet-13032847.pdf?src-supplier=element14+APAC; ComponentLink6Description: https://datasheet.octopart.com:443/RC1206FR-074K7L-Yageo-datasheet-13032847.pdf?src-supplier=element14+APAC; ComponentLink7URL: https://datasheet.octopart.com:443/RC1206FR-074K7L-Yageo-datasheet-62067350.pdf?src-supplier=Newark; ComponentLink7Description: https://datasheet.octopart.com:443/RC1206FR-074K7L-Yageo-datasheet-62067350.pdf?src-supplier=Newark; ComponentLink8URL: https://datasheet.octopart.com:443/RC1206FR-074K7L-Yageo-datasheet-164759695.pdf?src-supplier=Future+Electronics; ComponentLink8Description: https://datasheet.octopart.com:443/RC1206FR-074K7L-Yageo-datasheet-164759695.pdf?src-supplier=Future+Electronics; ComponentLink9URL: https://datasheet.octopart.com:443/RC1206FR-074K7L-Yageo-datasheet-137700087.pdf?src-supplier=Future+Electronics; ComponentLink9Description: https://datasheet.octopart.com:443/RC1206FR-074K7L-Yageo-datasheet-137700087.pdf?src-supplier=Future+Electronics; ComponentLink10URL: https://datasheet.octopart.com:443/RC1206FR-074K7L-Yageo-datasheet-27233761.pdf?src-supplier=Future+Electronics; ComponentLink10Description: https://datasheet.octopart.com:443/RC1206FR-074K7L-Yageo-datasheet-27233761.pdf?src-supplier=Future+Electronics; ComponentLink11URL: https://datasheet.octopart.com:443/RC1206FR-074K7L-Yageo-datasheet-8324387.pdf?src-supplier=Future+Electronics; ComponentLink11Description: https://datasheet.octopart.com:443/RC1206FR-074K7L-Yageo-datasheet-8324387.pdf?src-supplier=Future+Electronics; ComponentLink12URL: https://datasheet.octopart.com:443/RC1206FR-074K7L-Yageo-datasheet-79472498.pdf?src-supplier=Megastar; ComponentLink12Description: https://datasheet.octopart.com:443/RC1206FR-074K7L-Yageo-datasheet-79472498.pdf?src-supplier=Megastar; ComponentLink13URL: https://datasheet.octopart.com/RC1206FR-074K7L-Yageo-datasheet-73766026.pdf; ComponentLink13Description: https://datasheet.octopart.com/RC1206FR-074K7L-Yageo-datasheet-73766026.pdf; ComponentLink14URL: https://datasheet.octopart.com:443/RC1206FR-074K7L-Yageo-datasheet-118639.pdf?src-supplier=DigiKey; ComponentLink14Description: https://datasheet.octopart.com:443/RC1206FR-074K7L-Yageo-datasheet-118639.pdf?src-supplier=DigiKey; ComponentLink15URL: http://sigma.octopart.com:80/rohs_statement/Yageo-company-2.pdf?src-supplier=Compliance+Statements; ComponentLink15Description: http://sigma.octopart.com:80/rohs_statement/Yageo-company-2.pdf?src-supplier=Compliance+Statements; ComponentLink16URL: http://sigma.octopart.com:80/conflict_mineral_statement/Yageo-company-3.pdf?src-supplier=Compliance+Statements; ComponentLink16Description: http://sigma.octopart.com:80/conflict_mineral_statement/Yageo-company-3.pdf?src-supplier=Compliance+Statements; LCSC Part Number: C137262
R_330 = CMP-2003-04031-1: Manufacturer: Yageo; Part Number: RC1206JR-13330RL
S1 = HS-HS96L03W2C03-OLED: HS HS96L03W2C03 i2c OLED screen
SATA_POWER = SATA-15pin-power
SPKR1 = HC9042-16: Slim speaker from aliexpress
ST = CMP-14350-000004-1: IC INVERTER SCHMITT 6CH 14SO
TS1-TS3 = PTS645SH50SMTR92LFS: SWITCH TACTILE SPST-NO 0.05A 12V; Manufacturer: C&K Components; Actuator Material: Nylon, Polyamide; Contact Current Rating: 50mA; Contact Resistance: 100mΩ; Electrical Life: 100kcycles; Illumination Type: Illuminated, Non-Illuminated; Insulation Resistance: 100GΩ; Number of Positions: 1; Operating Force: 1.96N; Switch Function: Off-Mom; Throw Configuration: SPST; Supplier: DigiKey; Supplier Part Number: CKN9085CT-ND; Manufacturer Part Number: PTS645SH50SMTR92LFS; RoHS: Compliant; Category: Tactile Switches; Stock: 12847; Pricing: 1=0.3, 10=0.256, 25=0.3, 100=0.2139, 250=0.1982, 500=0.18706 (EUR); Case/Package: SMD/SMT; Color: Black; Contact Material: Bronze; Contact Plating: Silver; Current Rating: 50mA; Depth: 9mm; Height: 3.4544mm; Lead Free: Lead Free; Length: 6mm; Life (Cycles): 100kcycles; Lifecycle Status: Production; Max Current Rating: 50mA; Max Operating Temperature: 60°C; Max Voltage Rating (DC): 12V; Mechanical Life: 100kcycles; Min Operating Temperature: -20°C; Mounting Technology: Surface Mount; Orientation: Straight; Packaging: Tape & Reel (TR); REACH SVHC: Yes; Termination: Gull Wing; Voltage Rating (DC): 12V; ComponentLink1URL: https://datasheet.octopart.com:443/PTS645SH50SMTR92LFS-C%26K-Components-datasheet-169841344.pdf?src-supplier=Farnell; ComponentLink1Description: https://datasheet.octopart.com:443/PTS645SH50SMTR92LFS-C%26K-Components-datasheet-169841344.pdf?src-supplier=Farnell; ComponentLink2URL: https://datasheet.octopart.com:443/PTS645SH50SMTR92LFS-C%26K-Components-datasheet-165782998.pdf?src-supplier=Farnell; ComponentLink2Description: https://datasheet.octopart.com:443/PTS645SH50SMTR92LFS-C%26K-Components-datasheet-165782998.pdf?src-supplier=Farnell; ComponentLink3URL: https://datasheet.octopart.com:443/PTS645SH50SMTR92LFS-C%26K-Components-datasheet-67873720.pdf?src-supplier=Upverter; ComponentLink3Description: https://datasheet.octopart.com:443/PTS645SH50SMTR92LFS-C%26K-Components-datasheet-67873720.pdf?src-supplier=Upverter; ComponentLink4URL: https://datasheet.octopart.com:443/PTS645SH50SMTR92-LFS-C%26K-Components-datasheet-141421486.pdf?src-supplier=Upverter; ComponentLink4Description: https://datasheet.octopart.com:443/PTS645SH50SMTR92-LFS-C%26K-Components-datasheet-141421486.pdf?src-supplier=Upverter; ComponentLink5URL: https://datasheet.octopart.com:443/PTS645SH50SMTR92-LFS-C%26K-Components-datasheet-110647872.pdf?src-supplier=TME; ComponentLink5Description: https://datasheet.octopart.com:443/PTS645SH50SMTR92-LFS-C%26K-Components-datasheet-110647872.pdf?src-supplier=TME; ComponentLink6URL: https://datasheet.octopart.com:443/PTS645SH50SMTR-92-LFS-C%26K-Components-datasheet-150821959.pdf?src-supplier=TME; ComponentLink6Description: https://datasheet.octopart.com:443/PTS645SH50SMTR-92-LFS-C%26K-Components-datasheet-150821959.pdf?src-supplier=TME; ComponentLink7URL: https://datasheet.octopart.com:443/PTS645SH50SMTR92LFS-C%26K-Components-datasheet-138128951.pdf?src-supplier=Future+Electronics; ComponentLink7Description: https://datasheet.octopart.com:443/PTS645SH50SMTR92LFS-C%26K-Components-datasheet-138128951.pdf?src-supplier=Future+Electronics; ComponentLink8URL: https://datasheet.octopart.com:443/PTS645SH50SMTR92LFS-C%26K-Components-datasheet-62111174.pdf?src-supplier=Future+Electronics; ComponentLink8Description: https://datasheet.octopart.com:443/PTS645SH50SMTR92LFS-C%26K-Components-datasheet-62111174.pdf?src-supplier=Future+Electronics; ComponentLink9URL: https://datasheet.octopart.com:443/PTS645SH50SMTR92LFS-C%26K-Components-datasheet-24578962.pdf?src-supplier=Future+Electronics; ComponentLink9Description: https://datasheet.octopart.com:443/PTS645SH50SMTR92LFS-C%26K-Components-datasheet-24578962.pdf?src-supplier=Future+Electronics; ComponentLink10URL: https://datasheet.octopart.com:443/PTS645SH50SMTR92-LFS-C%26K-Components-datasheet-12590747.pdf?src-supplier=Future+Electronics; ComponentLink10Description: https://datasheet.octopart.com:443/PTS645SH50SMTR92-LFS-C%26K-Components-datasheet-12590747.pdf?src-supplier=Future+Electronics; LCSC Part Number: C221869
U1 = ESP32-S3-WROOM-1-N8R8: ESP32-S3R8 RF TXRX MOD BT WIFI PCB TH SMD; Manufacturer: Espressif Systems; Max Supply Voltage: 3.6V; Min Supply Voltage: 3V; Operating Supply Voltage: 3.3V; Supplier: DigiKey; Supplier Part Number: 5407-ESP32-S3-WROOM-1-N8R8CT-ND; Manufacturer Part Number: ESP32-S3-WROOM-1-N8R8; RoHS: Compliant; Category: System on Chip (SoC); Stock: 10970; Pricing: 1=5.22, 1=6.13, 10=4.528, 10=5.313, 25=5.22, 25=5.0276, 100=3.9504, 100=4.635, 250=3.75, 250=4.39984, 650=4.17352, 1300=4.02062, 1950=3.93533 (EUR); Height - Seated (Max): 3.25mm; Length: 25.5mm; Max Operating Temperature: 65°C; Min Operating Temperature: -40°C; Number of Terminals: 41; Terminal Pitch: 1.27mm; Width: 18mm; ComponentLink1URL: https://datasheet.octopart.com:443/ESP32-S3-WROOM-1-N8R8-Espressif-Systems-datasheet-165560563.pdf?src-supplier=IHS; ComponentLink1Description: https://datasheet.octopart.com:443/ESP32-S3-WROOM-1-N8R8-Espressif-Systems-datasheet-165560563.pdf?src-supplier=IHS; ComponentLink2URL: https://datasheet.octopart.com:443/ESP32-S3-WROOM-1-N8R8-Espressif-Systems-datasheet-175575506.pdf?src-supplier=SOS+electronic; ComponentLink2Description: https://datasheet.octopart.com:443/ESP32-S3-WROOM-1-N8R8-Espressif-Systems-datasheet-175575506.pdf?src-supplier=SOS+electronic; ComponentLink3URL: https://datasheet.octopart.com:443/ESP32-S3-WROOM-1-N8R8-Espressif-Systems-datasheet-164663773.pdf?src-supplier=SOS+electronic; ComponentLink3Description: https://datasheet.octopart.com:443/ESP32-S3-WROOM-1-N8R8-Espressif-Systems-datasheet-164663773.pdf?src-supplier=SOS+electronic; ComponentLink4URL: https://datasheet.octopart.com:443/ESP32-S3-WROOM-1-N8R8-Espressif-Systems-datasheet-188867343.pdf?src-supplier=TME; ComponentLink4Description: https://datasheet.octopart.com:443/ESP32-S3-WROOM-1-N8R8-Espressif-Systems-datasheet-188867343.pdf?src-supplier=TME; ComponentLink5URL: https://datasheet.octopart.com:443/ESP32-S3-WROOM-1-N8R8-Espressif-Systems-datasheet-165560559.pdf?src-supplier=TME; ComponentLink5Description: https://datasheet.octopart.com:443/ESP32-S3-WROOM-1-N8R8-Espressif-Systems-datasheet-165560559.pdf?src-supplier=TME; LCSC Part Number: C2913201; Parameter 1: *